# EAGLE design MKRFOX1200-LargePrototype (EAGLE 7.4.0)
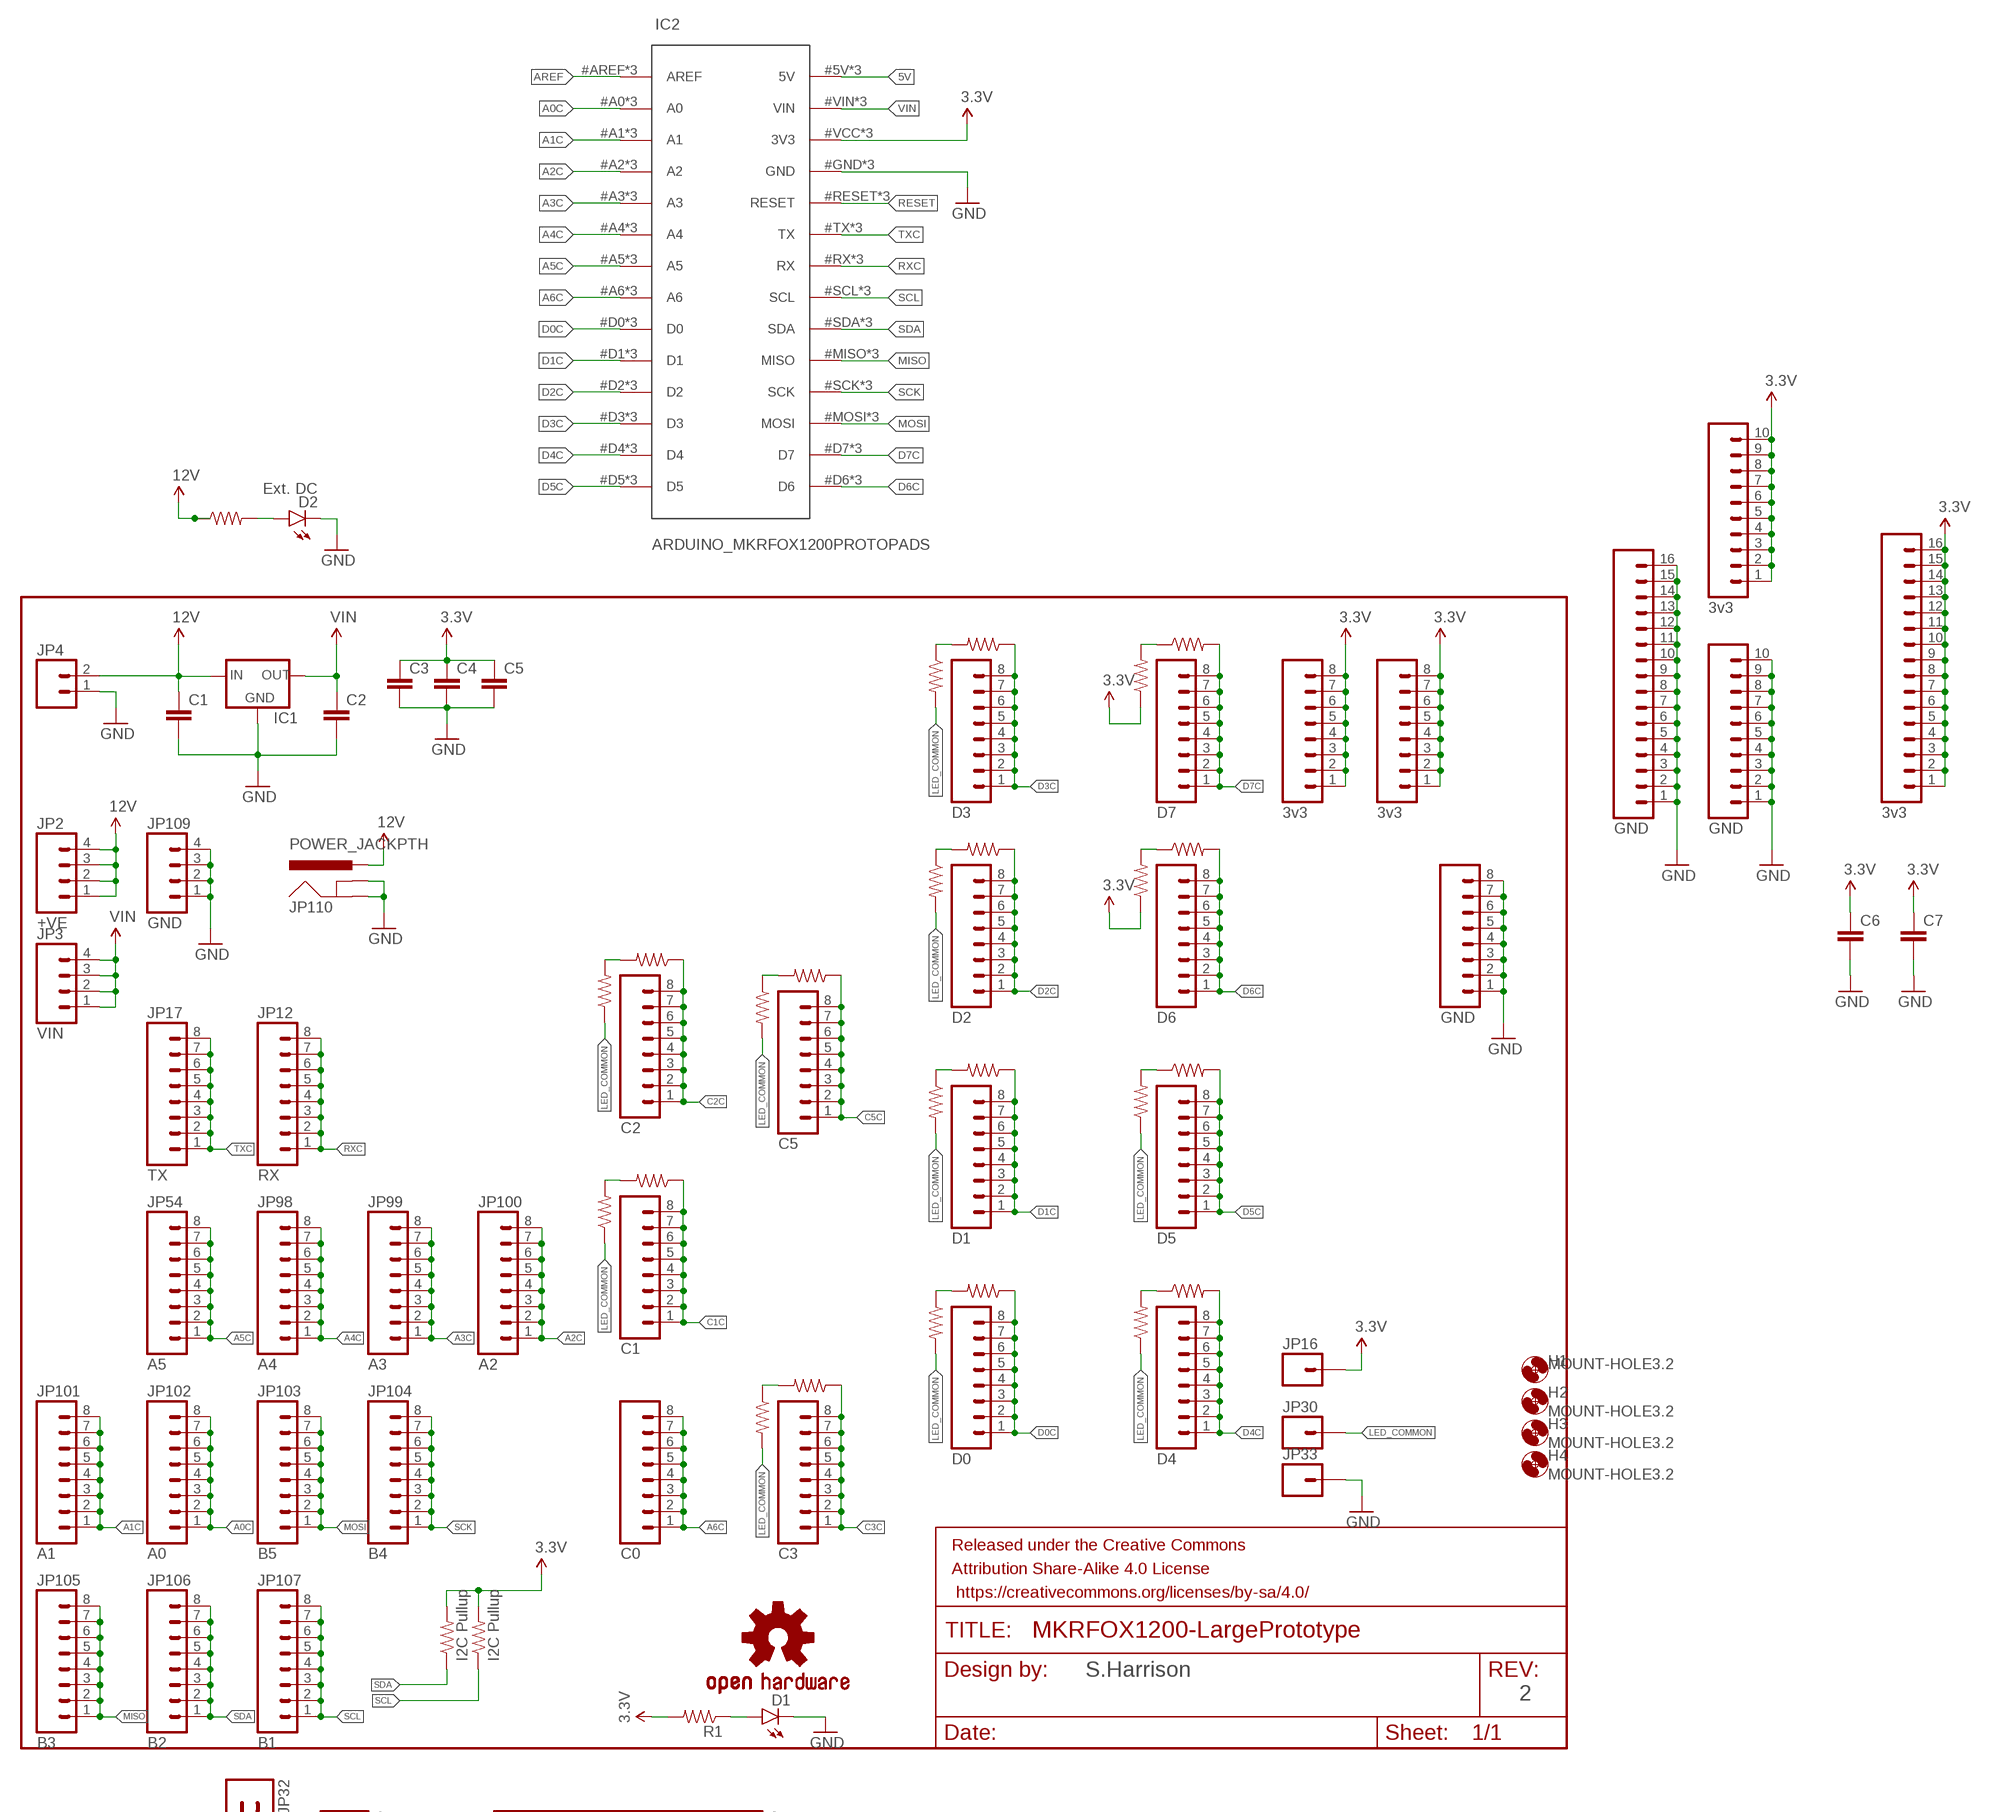
[diagram p0: schematic, sheet 1, part 1 of 2]
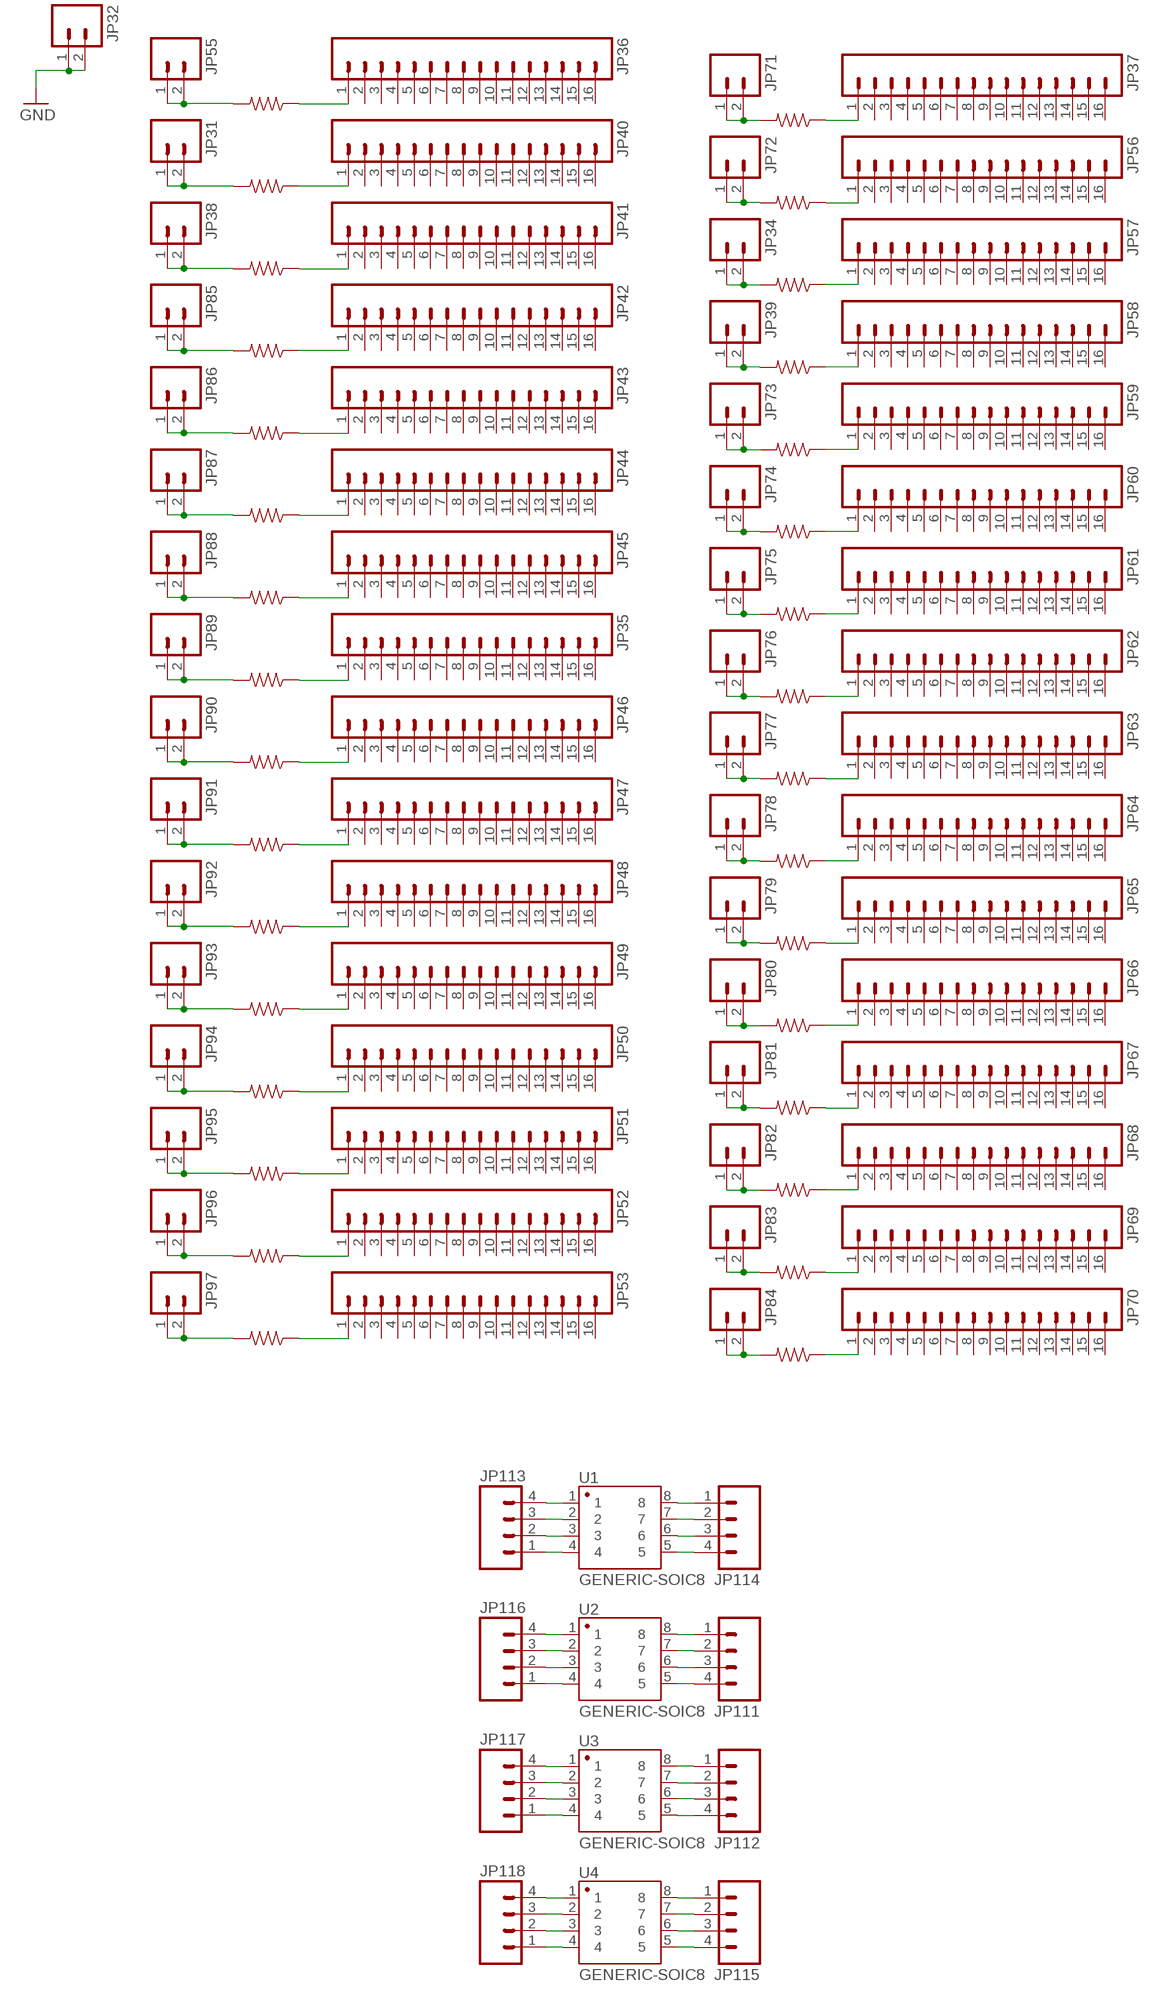
[diagram p1: schematic, sheet 1, part 2 of 2]

## Parts
3V1  3v3  M08  [1X08_ROUND]
3V3  3v3  M08  [1X08_ROUND]
C1  1UF-25V-10%(0805)"  [0805-CAP]
C2  1UF-25V-10%(0805)"  [0805-CAP]
C3  1UF-25V-10%(0805)"  [0805-CAP]
C4  1UF-25V-10%(0805)"  [0805-CAP]
C5  1UF-25V-10%(0805)"  [0805-CAP]
C6  1UF-25V-10%(0805)"  [0805-CAP]
C7  1UF-25V-10%(0805)"  [0805-CAP]
D1  LED1206-BOTTOM  [LED-1206-BOTTOM]
D2  Ext. DC  LED-RED1206  [LED-1206]
FRAME1  FRAME-LETTER  [CREATIVE_COMMONS]
H1  MOUNT-HOLE3.2  [3,2]
H2  MOUNT-HOLE3.2  [3,2]
H3  MOUNT-HOLE3.2  [3,2]
H4  MOUNT-HOLE3.2  [3,2]
IC1  78XXS  [78XXS]
IC2  ARDUINO_MKRFOX1200PROTOPADS  [ARDUINO_MKRFOX1200_PROTOPADS]
JP1  D7  M08  [1X08_ROUND]
JP2  +VE  M04PTH  [1X04]
JP3  VIN  M04PTH  [1X04]
JP4  M025MM  [SCREWTERMINAL-5MM-2]
JP5  3v3  M10SILK_FEMALE_PTH  [1X10]
JP7  D6  M08  [1X08_ROUND]
JP10  D5  M08  [1X08_ROUND]
JP11  GND  M10SILK_FEMALE_PTH  [1X10]
JP12  RX  M08  [1X08_ROUND]
JP13  3v3  M16PTH  [1X16]
JP14  GND  M16PTH  [1X16]
JP16  M01PTH  [1X01]
JP17  TX  M08  [1X08_ROUND]
JP18  D4  M08  [1X08_ROUND]
JP19  D3  M08  [1X08_ROUND]
JP20  D2  M08  [1X08_ROUND]
JP21  D1  M08  [1X08_ROUND]
JP22  D0  M08  [1X08_ROUND]
JP23  GND  M08  [1X08_ROUND]
JP24  C5  M08  [1X08_ROUND]
JP26  C3  M08  [1X08_ROUND]
JP27  C2  M08  [1X08_ROUND]
JP28  C1  M08  [1X08_ROUND]
JP29  C0  M08  [1X08_ROUND]
JP30  M01PTH  [1X01]
JP31  M02PTH  [1X02]
JP32  M02PTH  [1X02]
JP33  M01PTH  [1X01]
JP34  M02PTH  [1X02]
JP35  M161X16_NO_SILK  [1X16_NO_SILK]
JP36  M161X16_NO_SILK  [1X16_NO_SILK]
JP37  M161X16_NO_SILK  [1X16_NO_SILK]
JP38  M02PTH  [1X02]
JP39  M02PTH  [1X02]
JP40  M161X16_NO_SILK  [1X16_NO_SILK]
JP41  M161X16_NO_SILK  [1X16_NO_SILK]
JP42  M161X16_NO_SILK  [1X16_NO_SILK]
JP43  M161X16_NO_SILK  [1X16_NO_SILK]
JP44  M161X16_NO_SILK  [1X16_NO_SILK]
JP45  M161X16_NO_SILK  [1X16_NO_SILK]
JP46  M161X16_NO_SILK  [1X16_NO_SILK]
JP47  M161X16_NO_SILK  [1X16_NO_SILK]
JP48  M161X16_NO_SILK  [1X16_NO_SILK]
JP49  M161X16_NO_SILK  [1X16_NO_SILK]
JP50  M161X16_NO_SILK  [1X16_NO_SILK]
JP51  M161X16_NO_SILK  [1X16_NO_SILK]
JP52  M161X16_NO_SILK  [1X16_NO_SILK]
JP53  M161X16_NO_SILK  [1X16_NO_SILK]
JP54  A5  M08  [1X08_ROUND]
JP55  M02PTH  [1X02]
JP56  M161X16_NO_SILK  [1X16_NO_SILK]
JP57  M161X16_NO_SILK  [1X16_NO_SILK]
JP58  M161X16_NO_SILK  [1X16_NO_SILK]
JP59  M161X16_NO_SILK  [1X16_NO_SILK]
JP60  M161X16_NO_SILK  [1X16_NO_SILK]
JP61  M161X16_NO_SILK  [1X16_NO_SILK]
JP62  M161X16_NO_SILK  [1X16_NO_SILK]
JP63  M161X16_NO_SILK  [1X16_NO_SILK]
JP64  M161X16_NO_SILK  [1X16_NO_SILK]
JP65  M161X16_NO_SILK  [1X16_NO_SILK]
JP66  M161X16_NO_SILK  [1X16_NO_SILK]
JP67  M161X16_NO_SILK  [1X16_NO_SILK]
JP68  M161X16_NO_SILK  [1X16_NO_SILK]
JP69  M161X16_NO_SILK  [1X16_NO_SILK]
JP70  M161X16_NO_SILK  [1X16_NO_SILK]
JP71  M02PTH  [1X02]
JP72  M02PTH  [1X02]
JP73  M02PTH  [1X02]
JP74  M02PTH  [1X02]
JP75  M02PTH  [1X02]
JP76  M02PTH  [1X02]
JP77  M02PTH  [1X02]
JP78  M02PTH  [1X02]
JP79  M02PTH  [1X02]
JP80  M02PTH  [1X02]
JP81  M02PTH  [1X02]
JP82  M02PTH  [1X02]
JP83  M02PTH  [1X02]
JP84  M02PTH  [1X02]
JP85  M02PTH  [1X02]
JP86  M02PTH  [1X02]
JP87  M02PTH  [1X02]
JP88  M02PTH  [1X02]
JP89  M02PTH  [1X02]
JP90  M02PTH  [1X02]
JP91  M02PTH  [1X02]
JP92  M02PTH  [1X02]
JP93  M02PTH  [1X02]
JP94  M02PTH  [1X02]
JP95  M02PTH  [1X02]
JP96  M02PTH  [1X02]
JP97  M02PTH  [1X02]
JP98  A4  M08  [1X08_ROUND]
JP99  A3  M08  [1X08_ROUND]
JP100  A2  M08  [1X08_ROUND]
JP101  A1  M08  [1X08_ROUND]
JP102  A0  M08  [1X08_ROUND]
JP103  B5  M08  [1X08_ROUND]
JP104  B4  M08  [1X08_ROUND]
JP105  B3  M08  [1X08_ROUND]
JP106  B2  M08  [1X08_ROUND]
JP107  B1  M08  [1X08_ROUND]
JP109  GND  M04PTH  [1X04]
JP110  POWER_JACKPTH  [POWER_JACK_PTH]
JP111  M04NO_SILK_ALL_ROUND  [1X04_NO_SILK_ALL_ROUND]
JP112  M04NO_SILK_ALL_ROUND  [1X04_NO_SILK_ALL_ROUND]
JP113  M04NO_SILK_ALL_ROUND  [1X04_NO_SILK_ALL_ROUND]
JP114  M04NO_SILK_ALL_ROUND  [1X04_NO_SILK_ALL_ROUND]
JP115  M04NO_SILK_ALL_ROUND  [1X04_NO_SILK_ALL_ROUND]
JP116  M04NO_SILK_ALL_ROUND  [1X04_NO_SILK_ALL_ROUND]
JP117  M04NO_SILK_ALL_ROUND  [1X04_NO_SILK_ALL_ROUND]
JP118  M04NO_SILK_ALL_ROUND  [1X04_NO_SILK_ALL_ROUND]
LOGO3  OSHW-LOGOM  [OSHW-LOGO-M]
R1  RESISTOR1206  [1206]
R2  RESISTOR1206  [1206]
R3  RESISTOR1206  [1206]
R4  RESISTOR1206  [1206]
R5  RESISTOR1206  [1206]
R6  RESISTOR1206  [1206]
R7  RESISTOR1206  [1206]
R8  RESISTOR1206  [1206]
R9  RESISTOR1206  [1206]
R10  RESISTOR1206  [1206]
R11  RESISTOR1206  [1206]
R12  RESISTOR1206  [1206]
R13  RESISTOR1206  [1206]
R14  RESISTOR1206  [1206]
R15  RESISTOR1206  [1206]
R16  RESISTOR1206  [1206]
R17  RESISTOR1206  [1206]
R18  RESISTOR1206  [1206]
R19  RESISTOR1206  [1206]
R22  RESISTOR1206  [1206]
R23  RESISTOR1206  [1206]
R24  RESISTOR1206  [1206]
R25  RESISTOR1206  [1206]
R26  RESISTOR1206  [1206]
R27  RESISTOR1206  [1206]
R28  RESISTOR1206  [1206]
R30  RESISTOR1206  [1206]
R31  RESISTOR1206  [1206]
R32  RESISTOR1206  [1206]
R33  RESISTOR1206  [1206]
R34  RESISTOR1206  [1206]
R35  RESISTOR1206  [1206]
R36  RESISTOR1206  [1206]
R37  RESISTOR1206  [1206]
R38  RESISTOR1206  [1206]
R39  RESISTOR1206  [1206]
R40  RESISTOR1206  [1206]
R41  RESISTOR1206  [1206]
R42  RESISTOR1206  [1206]
R43  RESISTOR1206  [1206]
R44  RESISTOR1206  [1206]
R45  RESISTOR1206  [1206]
R46  RESISTOR1206  [1206]
R47  RESISTOR1206  [1206]
R48  RESISTOR1206  [1206]
R49  RESISTOR1206  [1206]
R50  RESISTOR1206  [1206]
R51  RESISTOR1206  [1206]
R52  RESISTOR1206  [1206]
R53  RESISTOR1206  [1206]
R54  RESISTOR1206  [1206]
R55  RESISTOR1206  [1206]
R56  RESISTOR1206  [1206]
R57  RESISTOR1206  [1206]
R58  RESISTOR1206  [1206]
R59  RESISTOR1206  [1206]
R60  RESISTOR1206  [1206]
R61  RESISTOR1206  [1206]
R64  I2C Pullup  RESISTOR1206  [1206]
R65  I2C Pullup  RESISTOR1206  [1206]
U1  GENERIC-SOIC8  [SO08-UNIVERSAL]
U2  GENERIC-SOIC8  [SO08-UNIVERSAL]
U3  GENERIC-SOIC8  [SO08-UNIVERSAL]
U4  GENERIC-SOIC8  [SO08-UNIVERSAL]

## Nets
3.3V: 3V1.1 3V1.2 3V1.3 3V1.4 3V1.5 3V1.6 3V1.7 3V1.8 3V3.1 3V3.2 3V3.3 3V3.4 3V3.5 3V3.6 3V3.7 3V3.8 C3.1 C4.1 C5.1 C6.1 C7.1 IC2.#VCC(3V3) IC2.@VCC(3V3) IC2.VCC(3V3) JP5.1 JP5.2 JP5.3 JP5.4 JP5.5 JP5.6 JP5.7 JP5.8 JP5.9 JP5.10 JP13.1 JP13.2 JP13.3 JP13.4 JP13.5 JP13.6 JP13.7 JP13.8 JP13.9 JP13.10 JP13.11 JP13.12 JP13.13 JP13.14 JP13.15 JP13.16 JP16.1 R1.2 R2.1 R5.1 R64.2 R65.2
5V: IC2.5V IC2.#5V(5V) IC2.@5V(5V)
12V: C1.1 IC1.IN JP2.1 JP2.2 JP2.3 JP2.4 JP4.2 JP110.PWR R28.1
A0C: IC2.#A0(A0) IC2.@A0(A0) IC2.A0 JP102.1 JP102.2 JP102.3 JP102.4 JP102.5 JP102.6 JP102.7 JP102.8
A1C: IC2.#A1(A1) IC2.@A1(A1) IC2.A1 JP101.1 JP101.2 JP101.3 JP101.4 JP101.5 JP101.6 JP101.7 JP101.8
A2C: IC2.#A2(A2) IC2.@A2(A2) IC2.A2 JP100.1 JP100.2 JP100.3 JP100.4 JP100.5 JP100.6 JP100.7 JP100.8
A3C: IC2.#A3(A3) IC2.@A3(A3) IC2.A3 JP99.1 JP99.2 JP99.3 JP99.4 JP99.5 JP99.6 JP99.7 JP99.8
A4C: IC2.#A4(A4) IC2.@A4(A4) IC2.A4 JP98.1 JP98.2 JP98.3 JP98.4 JP98.5 JP98.6 JP98.7 JP98.8
A5C: IC2.#A5(A5) IC2.@A5(A5) IC2.A5 JP54.1 JP54.2 JP54.3 JP54.4 JP54.5 JP54.6 JP54.7 JP54.8
A6C: IC2.#A6(A6) IC2.@A6(A6) IC2.A6 JP29.1 JP29.2 JP29.3 JP29.4 JP29.5 JP29.6 JP29.7 JP29.8
AREF: IC2.#AREF(AREF) IC2.@AREF(AREF) IC2.AREF
C1C: JP28.1 JP28.2 JP28.3 JP28.4 JP28.5 JP28.6 JP28.7 JP28.8 R26.1
C2C: JP27.1 JP27.2 JP27.3 JP27.4 JP27.5 JP27.6 JP27.7 JP27.8 R24.1
C3C: JP26.1 JP26.2 JP26.3 JP26.4 JP26.5 JP26.6 JP26.7 JP26.8 R22.1
C5C: JP24.1 JP24.2 JP24.3 JP24.4 JP24.5 JP24.6 JP24.7 JP24.8 R18.1
D0C: IC2.#D0(D0) IC2.@D0(D0) IC2.D0 JP22.1 JP22.2 JP22.3 JP22.4 JP22.5 JP22.6 JP22.7 JP22.8 R16.1
D1C: IC2.#D1(D1) IC2.@D1(D1) IC2.D1 JP21.1 JP21.2 JP21.3 JP21.4 JP21.5 JP21.6 JP21.7 JP21.8 R14.1
D2C: IC2.#D2(D2) IC2.@D2(D2) IC2.D2 JP20.1 JP20.2 JP20.3 JP20.4 JP20.5 JP20.6 JP20.7 JP20.8 R12.1
D3C: IC2.#D3(D3) IC2.@D3(D3) IC2.D3 JP19.1 JP19.2 JP19.3 JP19.4 JP19.5 JP19.6 JP19.7 JP19.8 R10.1
D4C: IC2.#D4(D4) IC2.@D4(D4) IC2.D4 JP18.1 JP18.2 JP18.3 JP18.4 JP18.5 JP18.6 JP18.7 JP18.8 R8.2
D5C: IC2.#D5(D5) IC2.@D5(D5) IC2.D5 JP10.1 JP10.2 JP10.3 JP10.4 JP10.5 JP10.6 JP10.7 JP10.8 R6.2
D6C: IC2.#D6(D6) IC2.@D6(D6) IC2.D6 JP7.1 JP7.2 JP7.3 JP7.4 JP7.5 JP7.6 JP7.7 JP7.8 R4.2
D7C: IC2.#D7(D7) IC2.@D7(D7) IC2.D7 JP1.1 JP1.2 JP1.3 JP1.4 JP1.5 JP1.6 JP1.7 JP1.8 R3.2
GND: C1.2 C2.2 C3.2 C4.2 C5.2 C6.2 C7.2 D1.C D2.C IC1.GND IC2.#GND(GND) IC2.@GND(GND) IC2.GND JP4.1 JP11.1 JP11.2 JP11.3 JP11.4 JP11.5 JP11.6 JP11.7 JP11.8 JP11.9 JP11.10 JP14.1 JP14.2 JP14.3 JP14.4 JP14.5 JP14.6 JP14.7 JP14.8 JP14.9 JP14.10 JP14.11 JP14.12 JP14.13 JP14.14 JP14.15 JP14.16 JP23.1 JP23.2 JP23.3 JP23.4 JP23.5 JP23.6 JP23.7 JP23.8 JP32.1 JP32.2 JP33.1 JP109.1 JP109.2 JP109.3 JP109.4 JP110.GND JP110.GNDBREAK
LED_COMMON: JP30.1 R7.1 R9.1 R11.2 R13.2 R15.2 R17.2 R19.2 R23.2 R25.1 R27.1
MISO: IC2.#MISO(MISO) IC2.@MISO(MISO) IC2.MISO JP105.1 JP105.2 JP105.3 JP105.4 JP105.5 JP105.6 JP105.7 JP105.8
MOSI: IC2.#MOSI(MOSI) IC2.@MOSI(MOSI) IC2.MOSI JP103.1 JP103.2 JP103.3 JP103.4 JP103.5 JP103.6 JP103.7 JP103.8
N$1: D1.A R1.1
N$2: JP113.4 U1.1
N$3: JP113.3 U1.2
N$4: R4.1 R5.2
N$5: R2.2 R3.1
N$6: R10.2 R11.1
N$7: JP113.2 U1.3
N$8: JP113.1 U1.4
N$9: JP114.1 U1.8
N$10: R8.1 R9.2
N$11: R6.1 R7.2
N$12: JP114.2 U1.7
N$13: R12.2 R13.1
N$14: R14.2 R15.1
N$15: R16.2 R17.1
N$16: JP114.3 U1.6
N$17: JP114.4 U1.5
N$18: JP116.4 U2.1
N$19: R18.2 R19.1
N$20: JP116.3 U2.2
N$22: JP116.2 U2.3
N$23: R22.2 R23.1
N$25: JP71.1 JP71.2 R46.2
N$26: JP116.1 U2.4
N$27: R26.2 R27.2
N$28: JP117.4 U3.1
N$29: R24.2 R25.2
N$30: JP117.3 U3.2
N$31: JP72.1 JP72.2 R47.2
N$32: JP34.1 JP34.2 R48.2
N$33: JP39.1 JP39.2 R49.2
N$34: JP73.1 JP73.2 R50.2
N$35: JP74.1 JP74.2 R51.2
N$36: JP75.1 JP75.2 R52.2
N$37: JP76.1 JP76.2 R53.2
N$38: JP77.1 JP77.2 R54.2
N$39: JP78.1 JP78.2 R55.2
N$40: JP79.1 JP79.2 R56.2
N$41: JP80.1 JP80.2 R57.2
N$42: JP81.1 JP81.2 R58.2
N$43: JP82.1 JP82.2 R59.2
N$44: JP83.1 JP83.2 R60.2
N$45: JP84.1 JP84.2 R61.2
N$46: JP70.1 R61.1
N$47: JP69.1 R60.1
N$48: JP68.1 R59.1
N$49: JP67.1 R58.1
N$50: JP66.1 R57.1
N$51: JP65.1 R56.1
N$52: JP64.1 R55.1
N$53: JP63.1 R54.1
N$54: JP62.1 R53.1
N$55: JP61.1 R52.1
N$56: JP60.1 R51.1
N$57: JP59.1 R50.1
N$58: JP58.1 R49.1
N$59: JP57.1 R48.1
N$60: JP56.1 R47.1
N$61: JP37.1 R46.1
N$62: JP97.1 JP97.2 R45.2
N$63: JP96.1 JP96.2 R44.2
N$64: JP95.1 JP95.2 R43.2
N$65: JP94.1 JP94.2 R42.2
N$66: JP93.1 JP93.2 R41.2
N$67: JP92.1 JP92.2 R40.2
N$68: JP91.1 JP91.2 R39.2
N$69: JP90.1 JP90.2 R38.2
N$70: JP89.1 JP89.2 R37.2
N$71: JP88.1 JP88.2 R36.2
N$72: JP87.1 JP87.2 R35.2
N$73: JP86.1 JP86.2 R34.2
N$74: JP85.1 JP85.2 R33.2
N$75: JP38.1 JP38.2 R32.2
N$76: JP55.1 JP55.2 R30.2
N$77: JP36.1 R30.1
N$78: JP40.1 R31.1
N$79: JP41.1 R32.1
N$80: JP42.1 R33.1
N$81: JP43.1 R34.1
N$82: JP44.1 R35.1
N$83: JP45.1 R36.1
N$84: JP35.1 R37.1
N$85: JP46.1 R38.1
N$86: JP47.1 R39.1
N$87: JP48.1 R40.1
N$88: JP49.1 R41.1
N$89: JP50.1 R42.1
N$90: JP51.1 R43.1
N$91: JP52.1 R44.1
N$92: JP53.1 R45.1
N$93: JP31.1 JP31.2 R31.2
N$94: D2.A R28.2
N$95: JP117.2 U3.3
N$96: JP117.1 U3.4
N$97: JP118.4 U4.1
N$98: JP118.3 U4.2
N$104: JP118.2 U4.3
N$128: JP118.1 U4.4
N$129: JP115.1 U4.8
N$130: JP115.2 U4.7
N$131: JP115.3 U4.6
N$132: JP115.4 U4.5
N$133: JP112.4 U3.5
N$134: JP112.3 U3.6
N$135: JP112.2 U3.7
N$136: JP112.1 U3.8
N$137: JP111.4 U2.5
N$138: JP111.3 U2.6
N$139: JP111.2 U2.7
N$140: JP111.1 U2.8
RESET: IC2.#RESET(RESET) IC2.@RESET(RESET) IC2.RESET
RXC: IC2.#RX(RX) IC2.@RX(RX) IC2.RX JP12.1 JP12.2 JP12.3 JP12.4 JP12.5 JP12.6 JP12.7 JP12.8
SCK: IC2.#SCK(SCK) IC2.@SCK(SCK) IC2.SCK JP104.1 JP104.2 JP104.3 JP104.4 JP104.5 JP104.6 JP104.7 JP104.8
SCL: IC2.#SCL(SCL) IC2.@SCL(SCL) IC2.SCL JP107.1 JP107.2 JP107.3 JP107.4 JP107.5 JP107.6 JP107.7 JP107.8 R64.1
SDA: IC2.#SDA(SDA) IC2.@SDA(SDA) IC2.SDA JP106.1 JP106.2 JP106.3 JP106.4 JP106.5 JP106.6 JP106.7 JP106.8 R65.1
TXC: IC2.#TX(TX) IC2.@TX(TX) IC2.TX JP17.1 JP17.2 JP17.3 JP17.4 JP17.5 JP17.6 JP17.7 JP17.8
VIN: C2.1 IC1.OUT IC2.#VIN(VIN) IC2.@VIN(VIN) IC2.VIN JP3.1 JP3.2 JP3.3 JP3.4
Unconnected: JP35.2 JP35.3 JP35.4 JP35.5 JP35.6 JP35.7 JP35.8 JP35.9 JP35.10 JP35.11 JP35.12 JP35.13 JP35.14 JP35.15 JP35.16 JP36.2 JP36.3 JP36.4 JP36.5 JP36.6 JP36.7 JP36.8 JP36.9 JP36.10 JP36.11 JP36.12 JP36.13 JP36.14 JP36.15 JP36.16 JP37.2 JP37.3 JP37.4 JP37.5 JP37.6 JP37.7 JP37.8 JP37.9 JP37.10 JP37.11 JP37.12 JP37.13 JP37.14 JP37.15 JP37.16 JP40.2 JP40.3 JP40.4 JP40.5 JP40.6 JP40.7 JP40.8 JP40.9 JP40.10 JP40.11 JP40.12 JP40.13 JP40.14 JP40.15 JP40.16 JP41.2 JP41.3 JP41.4 JP41.5 JP41.6 JP41.7 JP41.8 JP41.9 JP41.10 JP41.11 JP41.12 JP41.13 JP41.14 JP41.15 JP41.16 JP42.2 JP42.3 JP42.4 JP42.5 JP42.6 JP42.7 JP42.8 JP42.9 JP42.10 JP42.11 JP42.12 JP42.13 JP42.14 JP42.15 JP42.16 JP43.2 JP43.3 JP43.4 JP43.5 JP43.6 JP43.7 JP43.8 JP43.9 JP43.10 JP43.11 JP43.12 JP43.13 JP43.14 JP43.15 JP43.16 JP44.2 JP44.3 JP44.4 JP44.5 JP44.6 JP44.7 JP44.8 JP44.9 JP44.10 JP44.11 JP44.12 JP44.13 JP44.14 JP44.15 JP44.16 JP45.2 JP45.3 JP45.4 JP45.5 JP45.6 JP45.7 JP45.8 JP45.9 JP45.10 JP45.11 JP45.12 JP45.13 JP45.14 JP45.15 JP45.16 JP46.2 JP46.3 JP46.4 JP46.5 JP46.6 JP46.7 JP46.8 JP46.9 JP46.10 JP46.11 JP46.12 JP46.13 JP46.14 JP46.15 JP46.16 JP47.2 JP47.3 JP47.4 JP47.5 JP47.6 JP47.7 JP47.8 JP47.9 JP47.10 JP47.11 JP47.12 JP47.13 JP47.14 JP47.15 JP47.16 JP48.2 JP48.3 JP48.4 JP48.5 JP48.6 JP48.7 JP48.8 JP48.9 JP48.10 JP48.11 JP48.12 JP48.13 JP48.14 JP48.15 JP48.16 JP49.2 JP49.3 JP49.4 JP49.5 JP49.6 JP49.7 JP49.8 JP49.9 JP49.10 JP49.11 JP49.12 JP49.13 JP49.14 JP49.15 JP49.16 JP50.2 JP50.3 JP50.4 JP50.5 JP50.6 JP50.7 JP50.8 JP50.9 JP50.10 JP50.11 JP50.12 JP50.13 JP50.14 JP50.15 JP50.16 JP51.2 JP51.3 JP51.4 JP51.5 JP51.6 JP51.7 JP51.8 JP51.9 JP51.10 JP51.11 JP51.12 JP51.13 JP51.14 JP51.15 JP51.16 JP52.2 JP52.3 JP52.4 JP52.5 JP52.6 JP52.7 JP52.8 JP52.9 JP52.10 JP52.11 JP52.12 JP52.13 JP52.14 JP52.15 JP52.16 JP53.2 JP53.3 JP53.4 JP53.5 JP53.6 JP53.7 JP53.8 JP53.9 JP53.10 JP53.11 JP53.12 JP53.13 JP53.14 JP53.15 JP53.16 JP56.2 JP56.3 JP56.4 JP56.5 JP56.6 JP56.7 JP56.8 JP56.9 JP56.10 JP56.11 JP56.12 JP56.13 JP56.14 JP56.15 JP56.16 JP57.2 JP57.3 JP57.4 JP57.5 JP57.6 JP57.7 JP57.8 JP57.9 JP57.10 JP57.11 JP57.12 JP57.13 JP57.14 JP57.15 JP57.16 JP58.2 JP58.3 JP58.4 JP58.5 JP58.6 JP58.7 JP58.8 JP58.9 JP58.10 JP58.11 JP58.12 JP58.13 JP58.14 JP58.15 JP58.16 JP59.2 JP59.3 JP59.4 JP59.5 JP59.6 JP59.7 JP59.8 JP59.9 JP59.10 JP59.11 JP59.12 JP59.13 JP59.14 JP59.15 JP59.16 JP60.2 JP60.3 JP60.4 JP60.5 JP60.6 JP60.7 JP60.8 JP60.9 JP60.10 JP60.11 JP60.12 JP60.13 JP60.14 JP60.15 JP60.16 JP61.2 JP61.3 JP61.4 JP61.5 JP61.6 JP61.7 JP61.8 JP61.9 JP61.10 JP61.11 JP61.12 JP61.13 JP61.14 JP61.15 JP61.16 JP62.2 JP62.3 JP62.4 JP62.5 JP62.6 JP62.7 JP62.8 JP62.9 JP62.10 JP62.11 JP62.12 JP62.13 JP62.14 JP62.15 JP62.16 JP63.2 JP63.3 JP63.4 JP63.5 JP63.6 JP63.7 JP63.8 JP63.9 JP63.10 JP63.11 JP63.12 JP63.13 JP63.14 JP63.15 JP63.16 JP64.2 JP64.3 JP64.4 JP64.5 JP64.6 JP64.7 JP64.8 JP64.9 JP64.10 JP64.11 JP64.12 JP64.13 JP64.14 JP64.15 JP64.16 JP65.2 JP65.3 JP65.4 JP65.5 JP65.6 JP65.7 JP65.8 JP65.9 JP65.10 JP65.11 JP65.12 JP65.13 JP65.14 JP65.15 JP65.16 JP66.2 JP66.3 JP66.4 JP66.5 JP66.6 JP66.7 JP66.8 JP66.9 JP66.10 JP66.11 JP66.12 JP66.13 JP66.14 JP66.15 JP66.16 JP67.2 JP67.3 JP67.4 JP67.5 JP67.6 JP67.7 JP67.8 JP67.9 JP67.10 JP67.11 JP67.12 JP67.13 JP67.14 JP67.15 JP67.16 JP68.2 JP68.3 JP68.4 JP68.5 JP68.6 JP68.7 JP68.8 JP68.9 JP68.10 JP68.11 JP68.12 JP68.13 JP68.14 JP68.15 JP68.16 JP69.2 JP69.3 JP69.4 JP69.5 JP69.6 JP69.7 JP69.8 JP69.9 JP69.10 JP69.11 JP69.12 JP69.13 JP69.14 JP69.15 JP69.16 JP70.2 JP70.3 JP70.4 JP70.5 JP70.6 JP70.7 JP70.8 JP70.9 JP70.10 JP70.11 JP70.12 JP70.13 JP70.14 JP70.15 JP70.16

## Notes on the sheet
- S.Harrison
- 2

## Library data of the parts
3V1 3V3 JP1 JP7 JP10 JP12 JP17-JP24 JP26-JP29 JP54 JP98-JP107 = SparkFun-Connectors:M08: Header 8 Standard 8-pin 0.1" header. Use with straight break away headers (SKU : PRT-00116), right angle break away headers (PRT-00553), swiss pins (PRT-00743), machine pins (PRT-00117), and female headers (PRT-00115).
C1-C7 = SparkFun-Capacitors:1UF-25V-10%(0805): CAP-08064
D1 = SparkFun-LED:LED: LEDs Standard schematic elements and footprints for 5mm, 3mm, 1206, and 0603 sized LEDs. 5mm - Spark Fun Electronics SKU : COM-00529 (and others)
D2 = SparkFun-LED:LED-RED: Assorted Red LEDs LilyPad 1206- DIO-09912 1206- DIO-00809 0603- DIO-00819 "SMART" means more efficient and expensive; PROD_ID: DIO-09912; VALUE: RED
FRAME1 = SparkFun-Aesthetics:FRAME-LETTER: Schematic Frame Standard 8.5x11 US Letter frame
H1-H4 = holes:MOUNT-HOLE: MOUNTING HOLE with drill center marker
IC1 = v-reg:78XXS: VOLTAGE REGULATOR
IC2 = Arduino:ARDUINO_MKRFOX1200
JP2 JP3 JP109 JP111-JP118 = SparkFun-Connectors:M04: Header 4 Standard 4-pin 0.1" header. Use with straight break away headers (SKU : PRT-00116), right angle break away headers (PRT-00553), swiss pins (PRT-00743), machine pins (PRT-00117), and female headers (PRT-00115). Molex polarized connector foot print use with SKU : PRT-08231 with associated crimp pins and housings. 1MM SMD Version SKU: PRT-10208
JP4 = SparkFun-Connectors:M02: Standard 2-pin 0.1" header. Use with - straight break away headers ( PRT-00116) - right angle break away headers (PRT-00553) - swiss pins (PRT-00743) - machine pins (PRT-00117) - female headers (PRT-00115) Molex polarized connector foot print use with: PRT-08233 with associated crimp pins and housings. 2.54_SCREWTERM for use with PRT-10571. 3.5mm Screw Terminal footprints for PRT-08084 5mm Screw Terminal footprints for use with PRT-08432; STOREFRONT_ID: PRT-08432
JP5 JP11 = SparkFun-Connectors:M10: Header 10 Standard 10-pin 0.1" header. Use with straight break away headers (SKU : PRT-00116), right angle break away headers (PRT-00553), swiss pins (PRT-00743), machine pins (PRT-00117), and female headers (PRT-00115).; PROD_ID: CONN-11563
JP13 JP14 JP35-JP37 JP40-JP53 JP56-JP70 = SparkFun-Connectors:M16: 1x16 .1" header
JP16 JP30 JP33 = SparkFun-Connectors:M01: Header 1 Standard 1-pin 0.1" header. Use with straight break away headers (SKU : PRT-00116), right angle break away headers (PRT-00553), swiss pins (PRT-00743), machine pins (PRT-00117), and female headers (PRT-00115).
JP31 JP32 JP34 JP38 JP39 JP55 JP71-JP97 = SparkFun-Connectors:M02: Standard 2-pin 0.1" header. Use with - straight break away headers ( PRT-00116) - right angle break away headers (PRT-00553) - swiss pins (PRT-00743) - machine pins (PRT-00117) - female headers (PRT-00115) Molex polarized connector foot print use with: PRT-08233 with associated crimp pins and housings. 2.54_SCREWTERM for use with PRT-10571. 3.5mm Screw Terminal footprints for PRT-08084 5mm Screw Terminal footprints for use with PRT-08432
JP110 = SparkFun-Connectors:POWER_JACK: Power Jack This is the standard 5.5mm barrel jack for power. The PTH is the most common, proven, reliable, footprint. The Slot footprint only works if the mill layer is transmitted to the PCB fab house so be warned. Mating wall wart : TOL-00298 (and others); PROD_ID: CONN-08197
LOGO3 = SparkFun-Aesthetics:OSHW-LOGO: Open Source Hardware Logo This logo indicates the piece of hardware it is found on incorporates a OSHW license and/or adheres to the definition of open source hardware found here: http://freedomdefined.org/OSHW
R1-R19 R22-R28 R30-R61 R64 R65 = SparkFun-Resistors:RESISTOR: Resistor Basic schematic elements and footprints for 0603, 1206, and PTH resistors.
U1-U4 = SparkFun-AnalogIC:GENERIC-SOIC8: A placeholder for generic narrow & wide SOIC8 foorptints - used on the DIP adapter board.

## Board
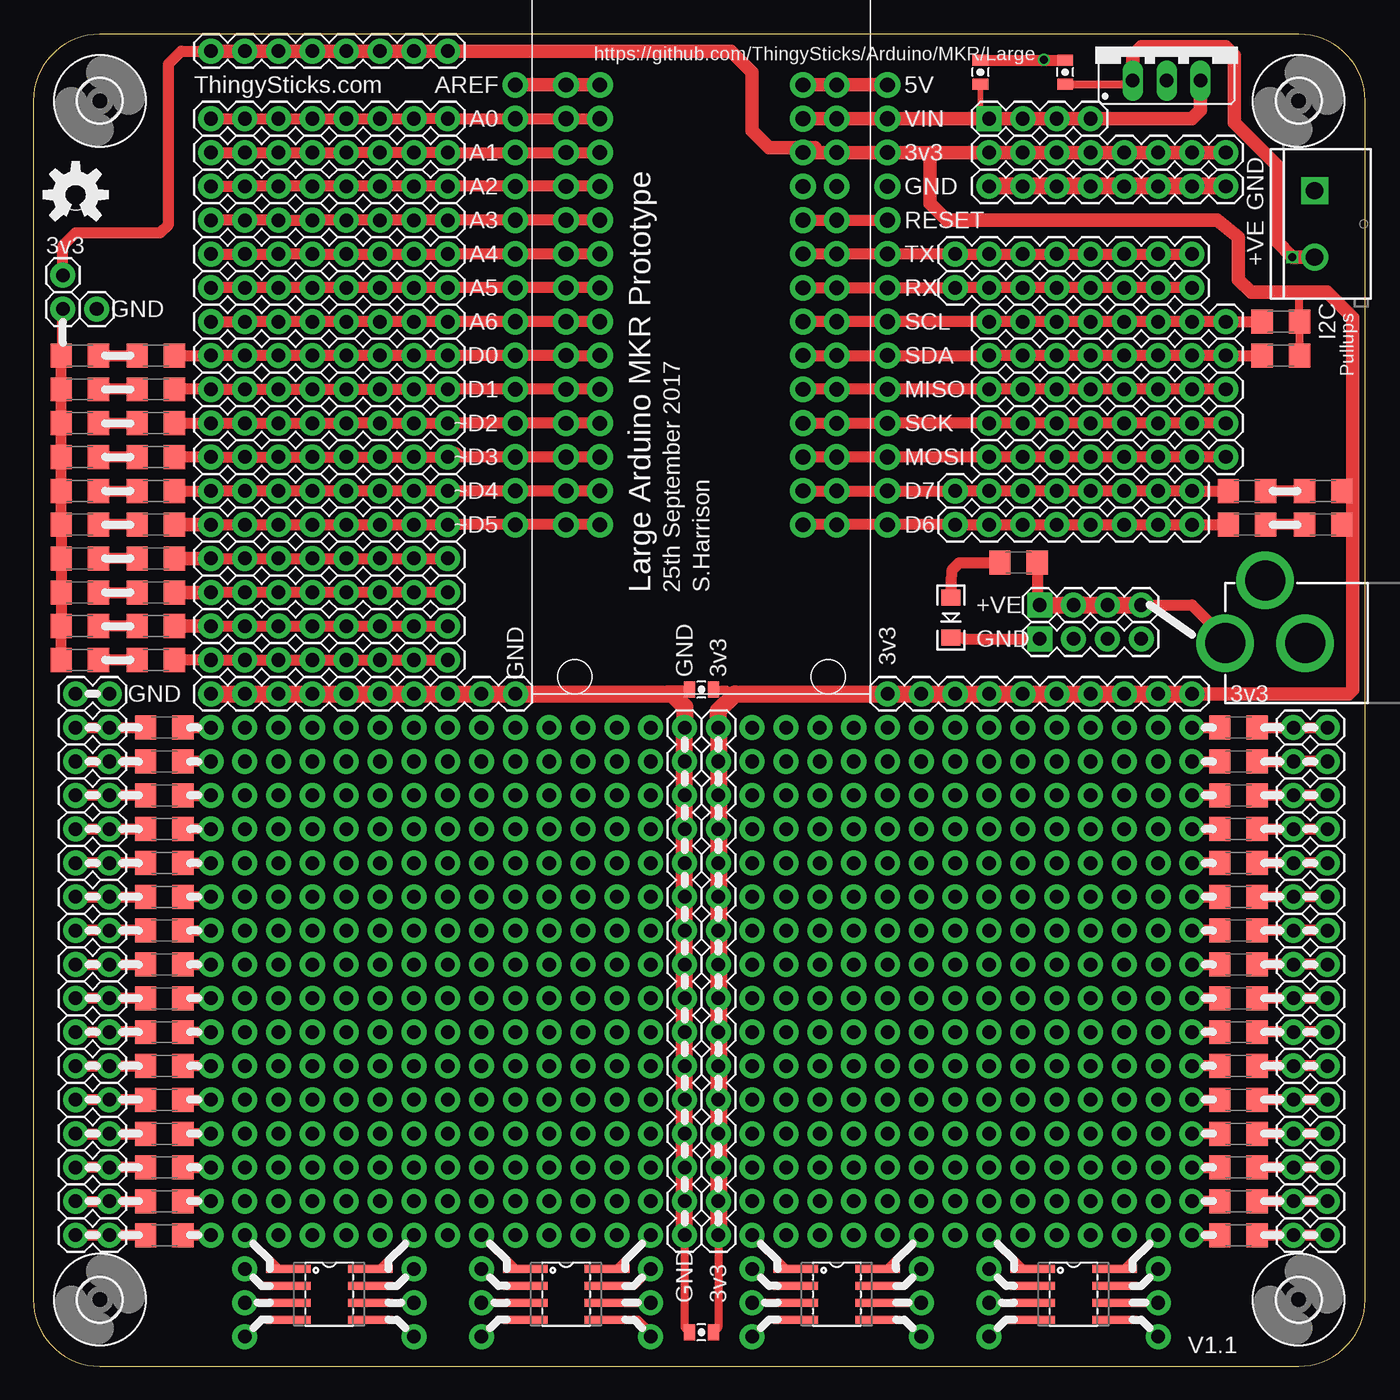
[diagram p2: board, top side]
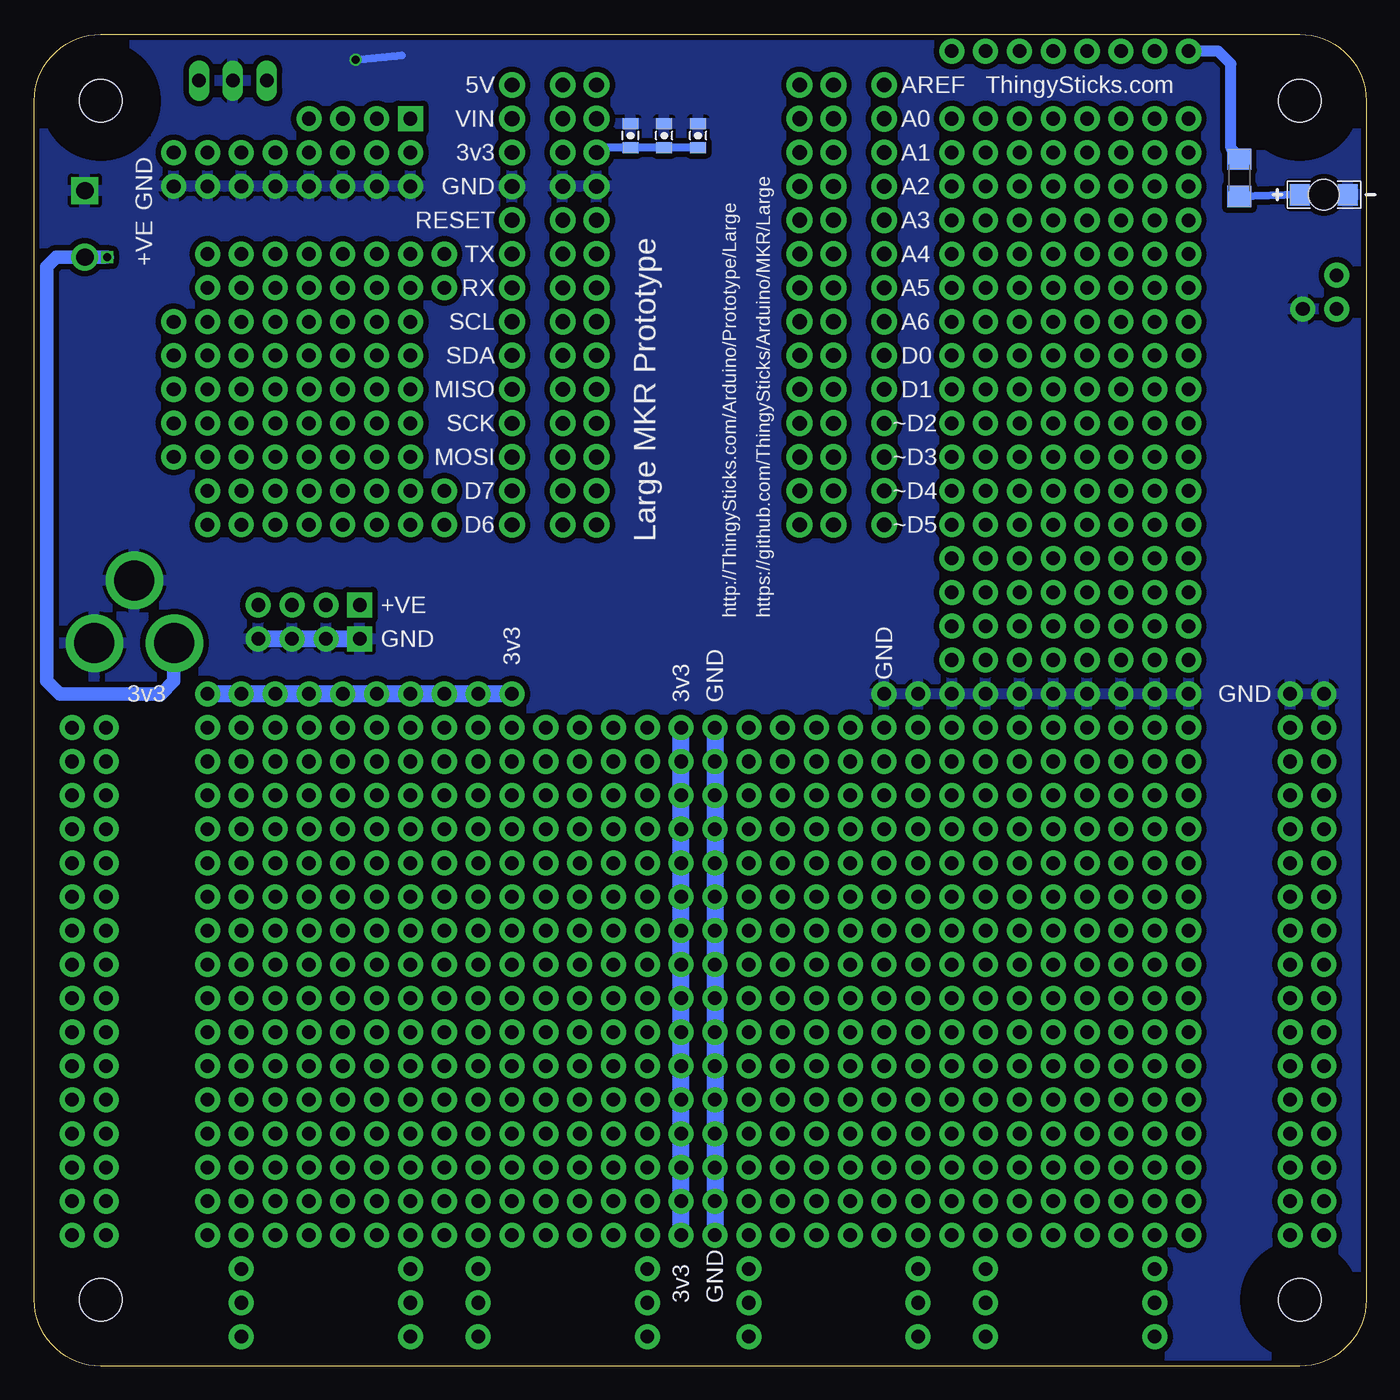
[diagram p3: board, bottom side, seen from below]

Size 100 x 100 mm. Coordinates in mm from the lower left corner, seen from the top.
Outline: 5,0 95,0 arc90 100,5 100,95 arc90 95,100 5,100 arc90 0,95 0,5 arc90 5,0
Copper layers (1*16): Top 0.035mm / dielectric 1.5mm / Bottom 0.035mm
Design rules "dirt_cheap_dirty_boards.v1": minimum track width 5mil, minimum drill 12mil, track to track 5mil, track to pad 5mil, pad to pad 5mil, via to via 5mil, smd to smd 0mil, copper to edge 10mil, drill to drill 10mil, minimum pad ring 10mil, minimum via ring 6mil, stop-mask expansion 2mil, vias tented up to drill 25mil, thermal gap 10mil

### Footprints (pad centres in the part's own frame; a part is rotated, then mirrored left to right if it is on the bottom)
1X08_ROUND = drill 1.016 pad 1.88: 1 0,0; 2 2.54,0; 3 5.08,0; 4 7.62,0; 5 10.16,0; 6 12.7,0; 7 15.24,0; 8 17.78,0
0805-CAP = smd 0.8 x 1.2: 1 -0.9,0; 2 0.9,0
LED-1206-BOTTOM = smd 1.5 x 1.6: A -1.8,0; C 1.8,0 | hole 2.3: 0,0
LED-1206 = smd 1.2 x 1.4: A -1.5,0; C 1.5,0
3,2 = hole 3.2: 0,0
78XXS = drill 1.016 long: GND 0,-2.54; IN -2.54,-2.54; OUT 2.54,-2.54
ARDUINO_MKRFOX1200_PROTOPADS = drill 1.1 pad 1.93: 5V 22.86,45.72; #5V 20.32,45.72; #A0 5.08,43.18; #A1 5.08,40.64; #A2 5.08,38.1; #A3 5.08,35.56; #A4 5.08,33.02; #A5 5.08,30.48; #A6 5.08,27.94; #AREF 5.08,45.72; #D0 5.08,25.4; #D1 5.08,22.86; #D2 5.08,20.32; #D3 5.08,17.78; #D4 5.08,15.24; #D5 5.08,12.7; #D6 20.32,12.7; #D7 20.32,15.24; #GND 20.32,38.1; #MISO 20.32,22.86; #MOSI 20.32,17.78; #RESET 20.32,35.56; #RX 20.32,30.48; #SCK 20.32,20.32; #SCL 20.32,27.94; #SDA 20.32,25.4; #TX 20.32,33.02; #VCC 20.32,40.64; #VIN 20.32,43.18; @5V 26.67,45.72; @A0 -1.27,43.18; @A1 -1.27,40.64; @A2 -1.27,38.1; @A3 -1.27,35.56; @A4 -1.27,33.02; @A5 -1.27,30.48; @A6 -1.27,27.94; @AREF -1.27,45.72; @D0 -1.27,25.4; @D1 -1.27,22.86; @D2 -1.27,20.32; @D3 -1.27,17.78; @D4 -1.27,15.24; @D5 -1.27,12.7; @D6 26.67,12.7; @D7 26.67,15.24; @GND 26.67,38.1; @MISO 26.67,22.86; @MOSI 26.67,17.78; @RESET 26.67,35.56; @RX 26.67,30.48; @SCK 26.67,20.32; @SCL 26.67,27.94; @SDA 26.67,25.4; @TX 26.67,33.02; @VCC 26.67,40.64; @VIN 26.67,43.18; A0 2.54,43.18; A1 2.54,40.64; A2 2.54,38.1; A3 2.54,35.56; A4 2.54,33.02; A5 2.54,30.48; A6 2.54,27.94; AREF 2.54,45.72; D0 2.54,25.4; D1 2.54,22.86; D2 2.54,20.32; D3 2.54,17.78; D4 2.54,15.24; D5 2.54,12.7; D6 22.86,12.7; D7 22.86,15.24; GND 22.86,38.1; MISO 22.86,22.86; MOSI 22.86,17.78; RESET 22.86,35.56; RX 22.86,30.48; SCK 22.86,20.32; SCL 22.86,27.94; SDA 22.86,25.4; TX 22.86,33.02; VCC 22.86,40.64; VIN 22.86,43.18
1X04 = drill 1.016 pad 1.88 square: 1 0,0 | drill 1.016 pad 1.88: 2 2.54,0; 3 5.08,0; 4 7.62,0
SCREWTERMINAL-5MM-2 = drill 1.3 pad 2.032 square: 1 0,0 | drill 1.3 pad 2.032: 2 5,0
1X10 = drill 1.016 pad 1.88: 1 0,0; 2 2.54,0; 3 5.08,0; 4 7.62,0; 5 10.16,0; 6 12.7,0; 7 15.24,0; 8 17.78,0; 9 20.32,0; 10 22.86,0
1X16 = drill 1.016 pad 1.88: 1 0,0; 2 2.54,0; 3 5.08,0; 4 7.62,0; 5 10.16,0; 6 12.7,0; 7 15.24,0; 8 17.78,0; 9 20.32,0; 10 22.86,0; 11 25.4,0; 12 27.94,0; 13 30.48,0; 14 33.02,0; 15 35.56,0; 16 38.1,0
1X01 = drill 1.016 pad 1.88: 1 0,0
1X02 = drill 1.016 pad 1.88: 1 0,0; 2 2.54,0
1X16_NO_SILK = drill 1.016 pad 1.88: 1 0,0; 2 2.54,0; 3 5.08,0; 4 7.62,0; 5 10.16,0; 6 12.7,0; 7 15.24,0; 8 17.78,0; 9 20.32,0; 10 22.86,0; 11 25.4,0; 12 27.94,0; 13 30.48,0; 14 33.02,0; 15 35.56,0; 16 38.1,0
POWER_JACK_PTH = drill 2.997 pad 4.318: GND 0,7.7; GNDBREAK 4.7,10.7; PWR 0,13.7
1X04_NO_SILK_ALL_ROUND = drill 1.016 pad 1.88: 1 0,0; 2 2.54,0; 3 5.08,0; 4 7.62,0
1206 = smd 1.6 x 1.8: 1 -1.4,0; 2 1.4,0
SO08-UNIVERSAL = smd 0.61 x 3.353: 1 -1.905,-3.073; 2 -0.635,-3.073; 3 0.635,-3.073; 4 1.905,-3.073; 5 1.905,3.073; 6 0.635,3.073; 7 -0.635,3.073; 8 -1.905,3.073

### Placement (x,y rotation side)
3V1  13.34,98.74 0 top
3V3  71.75,91.12 0 top
C1  77.47,97.16 90 top
C2  71.12,97.16 90 top
C3  50.16,92.39 90 bottom
C4  52.7,92.39 90 bottom
C5  55.24,92.39 90 bottom
C6  50.16,2.54 180 top
C7  50.16,50.8 180 top
D1  3.17,87.95 0 bottom
D2  68.9,56.2 270 top
FRAME1  17.09,-13.32 0 top  (outside the outline)
H1  5,5 0 top
H2  5,95 0 top
H3  95,95 0 top
H4  95,5 0 top
IC1  85.09,99.06 0 top
IC2  37.47,50.48 0 top
JP1  69.22,65.72 0 top
JP2  75.56,57.15 0 top
JP3  71.75,93.66 0 top
JP4  96.2,88.27 270 top
JP5  64.14,50.48 0 top
JP7  69.22,63.18 0 top
JP10  31.11,63.18 180 top
JP11  36.2,50.48 180 top
JP12  69.22,80.96 0 top
JP13  51.44,9.84 90 top
JP14  48.9,9.84 90 top
JP16  2.22,81.92 0 top
JP17  69.22,83.5 0 top
JP18  31.11,65.72 180 top
JP19  31.11,68.26 180 top
JP20  31.11,70.8 180 top
JP21  31.11,73.34 180 top
JP22  31.11,75.88 180 top
JP23  71.75,88.58 0 top
JP24  31.11,53.02 180 top
JP26  31.11,55.56 180 top
JP27  31.11,58.1 180 top
JP28  31.11,60.64 180 top
JP29  31.11,78.42 180 top
JP30  2.22,79.38 0 top
JP31  3.17,45.4 0 top
JP32  3.17,50.48 0 top
JP33  4.76,79.38 0 top
JP34  94.61,42.86 0 top
JP35  13.34,30.16 0 top
JP36  13.34,47.94 0 top
JP37  87,47.94 180 top
JP38  3.17,42.86 0 top
JP39  94.61,40.32 0 top
JP40  13.34,45.4 0 top
JP41  13.34,42.86 0 top
JP42  13.34,40.32 0 top
JP43  13.34,37.78 0 top
JP44  13.34,35.24 0 top
JP45  13.34,32.7 0 top
JP46  13.34,27.62 0 top
JP47  13.34,25.08 0 top
JP48  13.34,22.54 0 top
JP49  13.34,20 0 top
JP50  13.34,17.46 0 top
JP51  13.34,14.92 0 top
JP52  13.34,12.38 0 top
JP53  13.34,9.84 0 top
JP54  31.11,80.96 180 top
JP55  3.17,47.94 0 top
JP56  87,45.4 180 top
JP57  87,42.86 180 top
JP58  87,40.32 180 top
JP59  87,37.78 180 top
JP60  87,35.24 180 top
JP61  87,32.7 180 top
JP62  87,30.16 180 top
JP63  87,27.62 180 top
JP64  87,25.08 180 top
JP65  87,22.54 180 top
JP66  87,20 180 top
JP67  87,17.46 180 top
JP68  87,14.92 180 top
JP69  87,12.38 180 top
JP70  87,9.84 180 top
JP71  94.61,47.94 0 top
JP72  94.61,45.4 0 top
JP73  94.61,37.78 0 top
JP74  94.61,35.24 0 top
JP75  94.61,32.7 0 top
JP76  94.61,30.16 0 top
JP77  94.61,27.62 0 top
JP78  94.61,25.08 0 top
JP79  94.61,22.54 0 top
JP80  94.61,20 0 top
JP81  94.61,17.46 0 top
JP82  94.61,14.92 0 top
JP83  94.61,12.38 0 top
JP84  94.61,9.84 0 top
JP85  3.17,40.32 0 top
JP86  3.17,37.78 0 top
JP87  3.17,35.24 0 top
JP88  3.17,32.7 0 top
JP89  3.17,30.16 0 top
JP90  3.17,27.62 0 top
JP91  3.17,25.08 0 top
JP92  3.17,22.54 0 top
JP93  3.17,20 0 top
JP94  3.17,17.46 0 top
JP95  3.17,14.92 0 top
JP96  3.17,12.38 0 top
JP97  3.17,9.84 0 top
JP98  31.11,83.5 180 top
JP99  31.11,86.04 180 top
JP100  31.11,88.58 180 top
JP101  31.11,91.12 180 top
JP102  31.11,93.66 180 top
JP103  71.75,68.26 0 top
JP104  71.75,70.8 0 top
JP105  71.75,73.34 0 top
JP106  71.75,75.88 0 top
JP107  71.75,78.42 0 top
JP109  75.56,54.61 0 top
JP110  103.19,54.29 90 top
JP111  66.67,9.84 270 top
JP112  46.35,9.84 270 top
JP113  71.75,2.22 90 top
JP114  84.45,9.84 270 top
JP115  28.57,9.84 270 top
JP116  53.98,2.22 90 top
JP117  33.66,2.22 90 top
JP118  15.88,2.22 90 top
LOGO3  3.17,87.95 0 top
R1  9.53,89.22 90 bottom
R2  96.84,65.72 180 top
R3  91.12,65.72 180 top
R4  91.12,63.18 180 top
R5  96.84,63.18 180 top
R6  9.21,63.18 0 top
R7  3.49,63.18 0 top
R8  9.21,65.72 0 top
R9  3.49,65.72 0 top
R10  9.21,68.26 180 top
R11  3.49,68.26 180 top
R12  9.21,70.8 180 top
R13  3.49,70.8 180 top
R14  9.21,73.34 180 top
R15  3.49,73.34 180 top
R16  9.21,75.88 180 top
R17  3.49,75.88 180 top
R18  9.21,53.02 180 top
R19  3.49,53.02 180 top
R22  9.21,55.56 180 top
R23  3.49,55.56 180 top
R24  9.21,58.1 180 top
R25  3.49,58.1 0 top
R26  9.21,60.64 180 top
R27  3.49,60.64 0 top
R28  73.98,60.33 180 top
R30  9.84,47.94 180 top
R31  9.84,45.4 180 top
R32  9.84,42.86 180 top
R33  9.84,40.32 180 top
R34  9.84,37.78 180 top
R35  9.84,35.24 180 top
R36  9.84,32.7 180 top
R37  9.84,30.16 180 top
R38  9.84,27.62 180 top
R39  9.84,25.08 180 top
R40  9.84,22.54 180 top
R41  9.84,20 180 top
R42  9.84,17.46 180 top
R43  9.84,14.92 180 top
R44  9.84,12.38 180 top
R45  9.84,9.84 180 top
R46  90.49,47.94 0 top
R47  90.49,45.4 0 top
R48  90.49,42.86 0 top
R49  90.49,40.32 0 top
R50  90.49,37.78 0 top
R51  90.49,35.24 0 top
R52  90.49,32.7 0 top
R53  90.49,30.16 0 top
R54  90.49,27.62 0 top
R55  90.49,25.08 0 top
R56  90.49,22.54 0 top
R57  90.49,20 0 top
R58  90.49,17.46 0 top
R59  90.49,14.92 0 top
R60  90.49,12.38 0 top
R61  90.49,9.84 0 top
R64  93.66,78.42 0 top
R65  93.66,75.88 0 top
U1  78.11,5.4 270 top
U2  60.33,5.4 270 top
U3  40.01,5.4 270 top
U4  22.23,5.4 270 top

### Tracks (layer width: path | path; a pad name or v marks a point on that pad's centre or on a via)
3.3V
  Top 0.61: 51.06,48.31 JP13.16 | C7.1 52.07,50.8 52.7,50.16 52.7,50.48 | JP13.1 51.44,2.91 C6.1 | R65.2 R64.2 95.06,80.46 95.25,80.64 | 89.85,90.81 3V3.8
  Top 0.813: JP16.1 2.22,84.14 3.17,85.09 9.53,85.09 10.16,85.72 10.16,97.79 11.11,98.74 3V1.1 | R5.1 98.74,63.18 99.06,63.5 | R2.1 98.74,65.72 99.06,65.41
  Top 1.016: 67.31,91.12 IC2.@VCC IC2.VCC IC2.#VCC 58.69,91.49 C5.1 53.98,92.76 53.98,97.16 52.39,98.74 3V1.8 3V1.7 3V1.6 3V1.5 3V1.4 3V1.3 3V1.2 3V1.1 | 67.31,91.12 3V3.1 3V3.2 3V3.3 3V3.4 3V3.5 3V3.6 3V3.7 3V3.8 | 67.31,91.12 67.31,87.31 68.58,86.04 88.9,86.04 90.49,84.77 90.49,81.6 91.44,80.64 95.25,80.64 97.16,80.64 99.06,78.74 99.06,65.41 99.06,63.5 99.06,50.8 98.74,50.48 JP5.10
  Top 1.27: JP13.1 JP13.2 JP13.3 JP13.4 JP13.5 JP13.6 JP13.7 JP13.8 JP13.9 JP13.10 JP13.11 JP13.12 JP13.13 JP13.14 JP13.15 JP13.16 51.44,49.21 52.7,50.48 JP5.1 JP5.2 JP5.3 JP5.4 JP5.5 JP5.6 JP5.7 JP5.8 JP5.9 JP5.10
  Bottom 0.61: C3.1 C4.1 C5.1 57.41,91.49 IC2.#VCC
  Bottom 0.813: R1.2 9.53,90.81 10.16,91.44 10.16,97.79 11.11,98.74 3V1.1
  Bottom 1.27: JP5.1 JP5.10 | JP13.1 JP13.16
5V
  Top 1.016: IC2.#5V IC2.5V IC2.@5V
12V  (via drill 0.6)
  Top 0.61: JP2.1 75.3,57.42 | C1.1 82.28,96.25 arc90 IC1.IN | JP110.PWR 88.9,54.88
  Top 0.813: JP2.4 87,57.15 88.9,55.24 88.9,54.88 | 78.79,57.2 78.74,57.15 | R28.1 75.38,57.34 JP2.1
  Top 1.016: JP4.2 v94.53,83.27 93.34,84.45 93.34,90.17 90.17,93.34 90.17,98.42 89.53,99.06 83.19,99.06 82.55,98.42 IC1.IN
  Top 1.27: JP2.1 JP2.2 78.74,57.15 JP2.3 JP2.4
  Bottom 1.016: v94.53,83.27 98.34,83.27 99.06,82.55 99.06,51.44 98.11,50.48 90.49,50.48 89.53,51.44 89.53,54.24 JP110.PWR
A0C
  Top 0.813: JP102.8 JP102.7 JP102.6 JP102.5 JP102.4 JP102.3 JP102.2 JP102.1 IC2.@A0 IC2.A0 IC2.#A0
A1C
  Top 0.813: JP101.8 JP101.7 JP101.6 JP101.5 JP101.4 JP101.3 JP101.2 JP101.1 IC2.@A1 IC2.A1 IC2.#A1
A2C
  Top 0.813: JP100.8 JP100.7 JP100.6 JP100.5 JP100.4 JP100.3 JP100.2 JP100.1 IC2.@A2 IC2.A2 IC2.#A2
A3C
  Top 0.813: JP99.8 JP99.7 JP99.6 JP99.5 JP99.4 JP99.3 JP99.2 JP99.1 IC2.@A3 IC2.A3 IC2.#A3
A4C
  Top 0.813: JP98.8 JP98.7 JP98.6 JP98.5 JP98.4 JP98.3 JP98.2 JP98.1 IC2.@A4 IC2.A4 IC2.#A4
A5C
  Top 0.813: JP54.8 JP54.7 JP54.6 JP54.5 JP54.4 JP54.3 JP54.2 JP54.1 IC2.@A5 IC2.A5 IC2.#A5
A6C
  Top 0.813: JP29.8 JP29.7 JP29.6 JP29.5 JP29.4 JP29.3 JP29.2 JP29.1 IC2.@A6 IC2.A6 IC2.#A6
AREF
  Top 1.016: IC2.#AREF IC2.AREF IC2.@AREF
C1C
  Top 0.813: JP28.8 JP28.7 JP28.6 JP28.5 JP28.4 JP28.3 JP28.2 JP28.1
  Top 1.016: JP28.8 R26.1
C2C
  Top 0.813: JP27.1 JP27.2 JP27.3 JP27.4 JP27.5 JP27.6 JP27.7 JP27.8
  Top 1.016: JP27.8 R24.1
C3C
  Top 0.813: JP26.8 JP26.7 JP26.6 JP26.5 JP26.4 JP26.3 JP26.2 JP26.1
  Top 1.016: JP26.8 R22.1
C5C
  Top 0.813: JP24.1 JP24.2 JP24.3 JP24.4 JP24.5 JP24.6 JP24.7 JP24.8 R18.1
D0C
  Top 0.813: R16.1 JP22.8 JP22.7 JP22.6 JP22.5 JP22.4 JP22.3 JP22.2 JP22.1 IC2.@D0 IC2.D0 IC2.#D0
D1C
  Top 0.813: R14.1 JP21.8 JP21.7 JP21.6 JP21.5 JP21.4 JP21.3 JP21.2 JP21.1 IC2.@D1 IC2.D1 IC2.#D1
D2C
  Top 0.813: R12.1 JP20.8 JP20.7 JP20.6 JP20.5 JP20.4 JP20.3 JP20.2 JP20.1 IC2.@D2 IC2.D2 IC2.#D2
D3C
  Top 0.813: R10.1 JP19.8 JP19.7 JP19.6 JP19.5 JP19.4 JP19.3 JP19.2 JP19.1 31.43,68.58 31.75,68.58 32.07,68.26 IC2.@D3 IC2.D3 IC2.#D3
D4C
  Top 0.813: R8.2 JP18.8 JP18.7 JP18.6 JP18.5 JP18.4 JP18.3 JP18.2 JP18.1 IC2.@D4 IC2.D4 IC2.#D4
D5C
  Top 0.813: JP10.8 JP10.7 JP10.6 JP10.5 JP10.4 JP10.3 JP10.2 JP10.1 IC2.@D5 IC2.D5 IC2.#D5
  Top 1.016: R6.2 JP10.8
D6C
  Top 0.813: R4.2 JP7.8 JP7.7 JP7.6 JP7.5 JP7.4 JP7.3 JP7.2 JP7.1 IC2.@D6 IC2.D6 IC2.#D6
D7C
  Top 0.813: R3.2 JP1.8 JP1.7 JP1.6 JP1.5 JP1.4 JP1.3 JP1.2 JP1.1 IC2.@D7 IC2.D7 IC2.#D7
GND  (via drill 0.6)
  Top 0.406: v75.88,98.11 77.47,98.11 C1.2
  Top 0.61: 49.27,48.31 JP14.16 | C7.2 47.62,50.8 47.62,50.48 | JP14.1 48.9,2.91 C6.2
  Top 0.813: D2.C 69.76,54.7 69.85,54.61 JP109.1 | C2.2 C1.2
  Top 1.27: JP23.8 JP23.7 JP23.6 JP23.5 JP23.4 JP23.3 JP23.2 JP23.1 | JP14.1 JP14.2 JP14.3 JP14.4 JP14.5 JP14.6 JP14.7 JP14.8 JP14.9 JP14.10 JP14.11 JP14.12 JP14.13 JP14.14 JP14.15 JP14.16 48.9,49.53 47.94,50.48 47.62,50.48 JP11.1 JP11.2 JP11.3 JP11.4 JP11.5 JP11.6 JP11.7 JP11.8 JP11.9 JP11.10
  Bottom 0.61: v75.88,98.11 72.39,98.42
  Bottom 1.27: JP14.16 JP14.1 | JP109.1 JP109.4
  pour Bottom (isolate 0.406, rank 5): -0.64,100.33 100.33,100.33 100.33,-0.64 -0.64,-0.64
LED_COMMON
  Top 0.61: 2.09,76.39 2.09,79.25 JP30.1
  Top 0.813: 2.09,76.39 R17.2 R15.2 R13.2 R11.2 R9.1 R7.1 R27.1 R25.1 R23.2 R19.2
MISO
  Top 0.813: JP105.8 JP105.7 JP105.6 JP105.5 JP105.4 JP105.3 JP105.2 JP105.1 IC2.@MISO IC2.MISO IC2.#MISO
MOSI
  Top 0.813: JP103.8 JP103.7 JP103.6 JP103.5 JP103.4 JP103.3 JP103.2 JP103.1 IC2.@MOSI IC2.MOSI IC2.#MOSI
N$1
  Bottom 0.61: D1.A R1.1
N$2
  Top 0.61: JP113.4 74.3,7.3 U1.1
N$3
  Top 0.61: U1.2 73.03,6.03 JP113.3
N$4
  Top 0.813: R5.2 R4.1
N$5
  Top 0.813: R2.2 R3.1
N$6
  Top 0.813: R10.2 R11.1
N$7
  Top 0.61: JP113.2 U1.3
N$8
  Top 0.61: JP113.1 73.03,3.49 U1.4
N$9
  Top 0.61: JP114.1 81.92,7.3 U1.8
N$10
  Top 0.813: R9.2 R8.1
N$11
  Top 0.813: R6.1 R7.2
N$12
  Top 0.61: U1.7 83.19,6.03 JP114.2
N$13
  Top 0.813: R13.1 R12.2
N$14
  Top 0.813: R14.2 R15.1
N$15
  Top 0.813: R17.1 R16.2
N$16
  Top 0.61: U1.6 JP114.3
N$17
  Top 0.61: U1.5 83.19,3.49 JP114.4
N$18
  Top 0.61: JP116.4 56.52,7.3 U2.1
N$19
  Top 0.813: R18.2 R19.1
N$20
  Top 0.61: U2.2 55.24,6.03 JP116.3
N$22
  Top 0.61: U2.3 JP116.2
N$23
  Top 0.813: R22.2 R23.1
N$25
  Top 0.813: R46.2 JP71.1 JP71.2
N$26
  Top 0.61: U2.4 55.24,3.49 JP116.1
N$27
  Top 0.813: R26.2 R27.2
N$28
  Top 0.61: U3.1 36.2,7.3 | 36.2,7.3 35.56,7.3 | JP117.4 36.2,7.3
N$29
  Top 0.813: R25.2 R24.2
N$30
  Top 0.61: U3.2 34.92,6.03 JP117.3
N$31
  Top 0.813: R47.2 JP72.1 JP72.2
N$32
  Top 0.813: JP34.2 JP34.1 R48.2
N$33
  Top 0.813: R49.2 JP39.1 JP39.2
N$34
  Top 0.813: JP73.2 JP73.1 R50.2
N$35
  Top 0.813: JP74.2 JP74.1 R51.2
N$36
  Top 0.813: JP75.2 JP75.1 R52.2
N$37
  Top 0.813: JP76.2 JP76.1 R53.2
N$38
  Top 0.813: JP77.2 JP77.1 R54.2
N$39
  Top 0.813: JP78.2 JP78.1 R55.2
N$40
  Top 0.813: JP79.2 JP79.1 R56.2
N$41
  Top 0.813: JP80.2 JP80.1 R57.2
N$42
  Top 0.813: JP81.2 JP81.1 R58.2
N$43
  Top 0.813: JP82.2 JP82.1 R59.2
N$44
  Top 0.813: JP83.2 JP83.1 R60.2
N$45
  Top 0.813: JP84.2 JP84.1 R61.2
N$46
  Top 0.813: JP70.1 R61.1
N$47
  Top 0.813: R60.1 JP69.1
N$48
  Top 0.813: JP68.1 R59.1
N$49
  Top 0.813: R58.1 JP67.1
N$50
  Top 0.813: JP66.1 R57.1
N$51
  Top 0.813: R56.1 JP65.1
N$52
  Top 0.813: JP64.1 R55.1
N$53
  Top 0.813: R54.1 JP63.1
N$54
  Top 0.813: JP62.1 R53.1
N$55
  Top 0.813: R52.1 JP61.1
N$56
  Top 0.813: JP60.1 R51.1
N$57
  Top 0.813: R50.1 JP59.1
N$58
  Top 0.813: JP58.1 R49.1
N$59
  Top 0.813: R48.1 JP57.1
N$60
  Top 0.813: JP56.1 R47.1
N$61
  Top 0.813: JP37.1 R46.1
N$62
  Top 0.813: R45.2 JP97.2 JP97.1
N$63
  Top 0.813: JP96.1 JP96.2 R44.2
N$64
  Top 0.813: R43.2 JP95.2 JP95.1
N$65
  Top 0.813: JP94.1 JP94.2 R42.2
N$66
  Top 0.813: R41.2 JP93.2 JP93.1
N$67
  Top 0.813: JP92.1 JP92.2 R40.2
N$68
  Top 0.813: JP91.1 JP91.2 R39.2
N$69
  Top 0.813: R38.2 JP90.2 JP90.1
N$70
  Top 0.813: JP89.1 JP89.2 R37.2
N$71
  Top 0.813: R36.2 JP88.2 JP88.1
N$72
  Top 0.813: JP87.1 JP87.2 R35.2
N$73
  Top 0.813: R34.2 JP86.2 JP86.1
N$74
  Top 0.813: JP85.1 JP85.2 R33.2
N$75
  Top 0.813: R32.2 JP38.2 JP38.1
N$76
  Top 0.813: JP55.1 JP55.2 R30.2
N$77
  Top 0.813: R30.1 JP36.1
N$78
  Top 0.813: JP40.1 R31.1
N$79
  Top 0.813: R32.1 JP41.1
N$80
  Top 0.813: JP42.1 R33.1
N$81
  Top 0.813: R34.1 JP43.1
N$82
  Top 0.813: JP44.1 R35.1
N$83
  Top 0.813: R36.1 JP45.1
N$84
  Top 0.813: R37.1 JP35.1
N$85
  Top 0.813: JP46.1 R38.1
N$86
  Top 0.813: R39.1 JP47.1
N$87
  Top 0.813: JP48.1 R40.1
N$88
  Top 0.813: R41.1 JP49.1
N$89
  Top 0.813: JP50.1 R42.1
N$90
  Top 0.813: R43.1 JP51.1
N$91
  Top 0.813: JP52.1 R44.1
N$92
  Top 0.813: JP53.1 R45.1
N$93
  Top 0.813: JP31.1 JP31.2 R31.2
N$94
  Top 0.813: D2.A 68.98,59.78 69.53,60.33 R28.2
N$95
  Top 0.61: U3.3 JP117.2
N$96
  Top 0.61: U3.4 34.92,3.49 JP117.1
N$97
  Top 0.61: JP118.4 18.41,7.3 U4.1
N$98
  Top 0.61: U4.2 17.14,6.03 JP118.3
N$104
  Top 0.61: U4.3 JP118.2
N$128
  Top 0.61: U4.4 17.14,3.49 JP118.1
N$129
  Top 0.61: U4.8 26.04,7.3 | 26.04,7.3 26.67,7.3 | JP115.1 26.04,7.3
N$130
  Top 0.61: U4.7 27.3,6.03 JP115.2
N$131
  Top 0.61: U4.6 JP115.3
N$132
  Top 0.61: U4.5 27.3,3.49 JP115.4
N$133
  Top 0.61: JP112.4 46.35,2.54 45.4,3.49 U3.5
N$134
  Top 0.61: U3.6 JP112.3
N$135
  Top 0.61: U3.7 45.09,6.03 JP112.2
N$136
  Top 0.61: JP112.1 43.81,7.3 U3.8
N$137
  Top 0.61: U2.5 65.41,3.49 JP111.4
N$138
  Top 0.61: U2.6 JP111.3
N$139
  Top 0.61: U2.7 65.41,6.03 JP111.2
N$140
  Top 0.61: JP111.1 64.14,7.3 U2.8
RESET
  Top 0.813: IC2.#RESET IC2.RESET IC2.@RESET
RXC
  Top 0.813: JP12.8 JP12.7 JP12.6 JP12.5 JP12.4 JP12.3 JP12.2 JP12.1 IC2.@RX IC2.RX IC2.#RX
SCK
  Top 0.813: JP104.8 JP104.7 JP104.6 JP104.5 JP104.4 JP104.3 JP104.2 JP104.1 IC2.@SCK IC2.SCK IC2.#SCK
SCL
  Top 0.813: R64.1 JP107.8 JP107.7 JP107.6 JP107.5 JP107.4 JP107.3 JP107.2 JP107.1 IC2.@SCL IC2.SCL IC2.#SCL
SDA
  Top 0.813: IC2.#SDA IC2.SDA IC2.@SDA JP106.1 JP106.2 JP106.3 JP106.4 JP106.5 JP106.6 JP106.7 JP106.8 R65.1
TXC
  Top 0.813: JP17.8 JP17.7 JP17.6 JP17.5 JP17.4 JP17.3 JP17.2 JP17.1 IC2.@TX IC2.TX IC2.#TX
VIN
  Top 0.406: C2.1 71.12,93.66
  Top 1.016: IC2.#VIN IC2.VIN IC2.@VIN 71.12,93.66 JP3.1 JP3.2 JP3.3 JP3.4 87,93.66 87.63,94.3 IC1.OUT

### Text on the board
tNames: https://github.com/ThingySticks/Arduino/MKR/Large | ThingySticks.com | GND | +VE | 3v3 | GND | I2C | Pullups | Large Arduino MKR Prototype | 25th September 2017 | S.Harrison | +VE | GND | 3v3 | GND | GND | 3v3 | GND | 3v3 | GND | 3v3 | V1.1
bNames: ThingySticks.com | GND | +VE | Large MKR Prototype | +VE | GND | https://github.com/ThingySticks/Arduino/MKR/Large | http://ThingySticks.com/Arduino/Prototype/Large | 3v3 | GND | GND | GND | 3v3 | 3v3 | GND | 3v3